# Altium project DataLoggingThermometer.PrjPcb
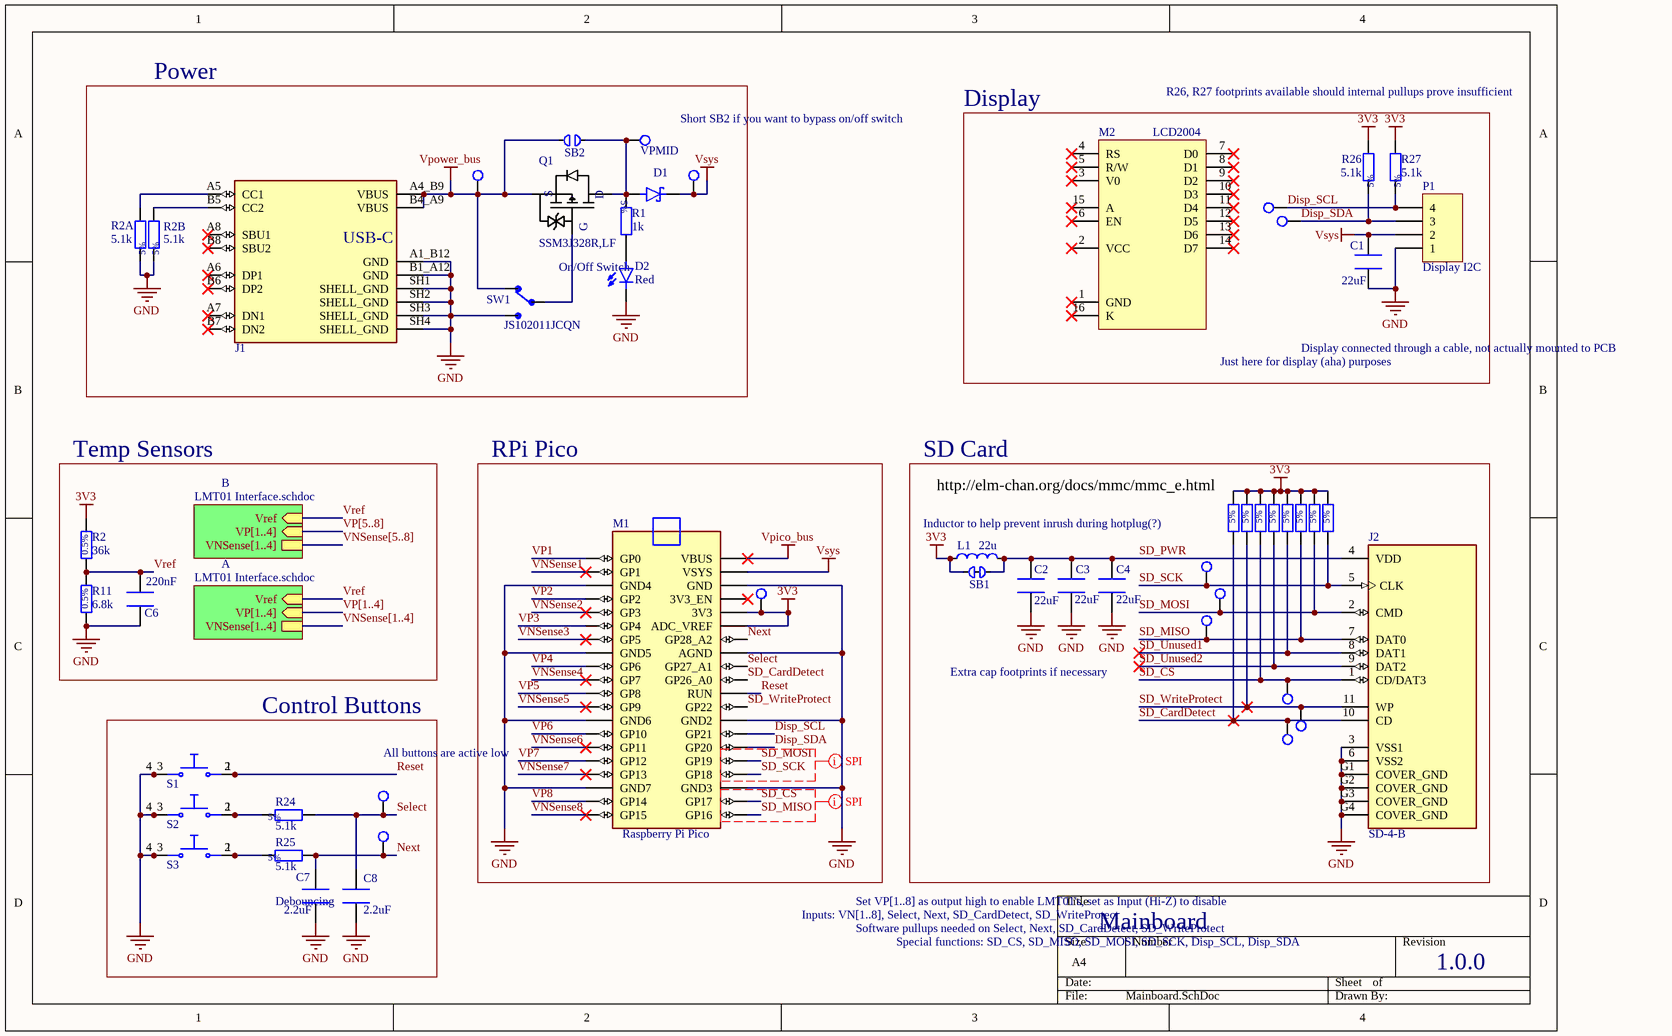
[diagram p0: Mainboard.SchDoc]
version: 1.0.0
2 sheets, 113 parts. Net scope: hierarchical (ports join the sheet entries above them; power ports are global).
Board file: Mainboard.PcbDoc
Sheets:
  Mainboard.SchDoc
    B = LMT01 Interface.schdoc
    A = LMT01 Interface.schdoc

## Sheet Mainboard.SchDoc
size A4

### Parts
3V3  Test Pad  [Test Pad]  (value not drawn)  (no BOM)
C1  22uF  [CAPACITOR_0805_2012M-70N]
C2  22uF  [CAPACITOR_0805_2012M-70N]
C3  22uF  [CAPACITOR_0805_2012M-70N]
C4  22uF  [CAPACITOR_0805_2012M-70N]
C6  220nF  [CAPACITOR_0805_2012M-70N]
C7  2.2uF  [CAPACITOR_0805_2012M-70N]
C8  2.2uF  [CAPACITOR_0805_2012M-70N]
CS  Test Pad  [Test Pad]  (value not drawn)  (no BOM)
D1  SS0520_R1_00001  [SOD123-1.35mm-N]  (value not drawn)
D2  Colour: Red  [LED_0603_1608M_0.80mm]  (hidden comment: LTST-C190 Series)
J1  USB4105-GF-A  [GCT_USB4105-GF-A]  (value not drawn)
J2  SD-4-B  [CUI_SD-4-B]
L1  22u  [CAPACITOR_1210_3225M_270N]
M1  RASPBERRY_PI_PICO  [RASPBERRY_PI_PICO_SOCKETED]  (value not drawn)
M2  LCD2004  [LCD2004]
MISO  Test Pad  [Test Pad]  (value not drawn)  (no BOM)
MOSI  Test Pad  [Test Pad]  (value not drawn)  (no BOM)
NXT  Test Pad  [Test Pad]  (value not drawn)  (no BOM)
P1  Display I2C  [HDR1X4H]  (no BOM)
Q1  SSM3J328R,LF  [SOT23F-3-0.8mm]
R1  1k  [Resistor_0805_2012M-50N]
R2  36k  [Resistor_0805_2012M-50N]
R2A  5.1k  [Resistor_0805_2012M-50N]
R2B  5.1k  [Resistor_0805_2012M-50N]
R3  47k  [Resistor_0805_2012M-50N]  (value not drawn)
R4  47k  [Resistor_0805_2012M-50N]  (value not drawn)
R5  47k  [Resistor_0805_2012M-50N]  (value not drawn)
R6  47k  [Resistor_0805_2012M-50N]  (value not drawn)
R7  47k  [Resistor_0805_2012M-50N]  (value not drawn)
R8  47k  [Resistor_0805_2012M-50N]  (value not drawn)
R9  47k  [Resistor_0805_2012M-50N]  (value not drawn)
R10  47k  [Resistor_0805_2012M-50N]  (value not drawn)
R11  6.8k  [Resistor_0805_2012M-50N]
R24  5.1k  [Resistor_0805_2012M-50N]
R25  5.1k  [Resistor_0805_2012M-50N]
R26  5.1k  [Resistor_0805_2012M-50N]
R27  5.1k  [Resistor_0805_2012M-50N]
S1  PTS645SL43SMTR92LFS  [SW_PTS645SL43SMTR92LFS]  (value not drawn)
S2  PTS645SL43SMTR92LFS  [SW_PTS645SL43SMTR92LFS]  (value not drawn)
S3  PTS645SL43SMTR92LFS  [SW_PTS645SL43SMTR92LFS]  (value not drawn)
SB1  Solder Jumper Normally Closed 0201  [Solder Bridge Closed 0201]  (value not drawn)  (net tie, no BOM)
SB2  Solder Jumper Normally Open 0201  [Solder Bridge Open 0201]  (value not drawn)  (no BOM)
SCK  Test Pad  [Test Pad]  (value not drawn)  (no BOM)
SCL  Test Pad  [Test Pad]  (value not drawn)  (no BOM)
SD_CD  Test Pad  [Test Pad]  (value not drawn)  (no BOM)
SD_WP  Test Pad  [Test Pad]  (value not drawn)  (no BOM)
SDA  Test Pad  [Test Pad]  (value not drawn)  (no BOM)
SEL  Test Pad  [Test Pad]  (value not drawn)  (no BOM)
SW1  JS102011JCQN  [SW_JS102011JCQN]
VPBUS  Test Pad  [Test Pad]  (value not drawn)  (no BOM)
VPMID  Test Pad  [Test Pad]  (value not drawn)  (no BOM)
VSYS  Test Pad  [Test Pad]  (value not drawn)  (no BOM)

### Blocks framed on the sheet
Power: D1 D2 J1 Q1 R1 R2A R2B SB2 SW1 VPBUS VPMID VSYS
Display: C1 M2 P1 R26 R27 SCL SDA
Temp Sensors: C6 R2 R11
RPi Pico: 3V3 M1
SD Card: C2-C4 CS J2 L1 MISO MOSI R3-R10 SB1 SCK SD_CD SD_WP
Control Buttons: C7 C8 NXT R24 R25 S1-S3 SEL

### Sub-sheets
A = LMT01 Interface.schdoc: VP[1..4] (in), VNSense[1..4], Vref (in)
B = LMT01 Interface.schdoc: VP[1..4] (in), VNSense[1..4], Vref (in)

### Nets
3V3: 3V3.1 L1.1 M1.3V3 M1.ADC_VREF R2.2 R3.2 R4.2 R5.2 R6.2 R7.2 R8.2 R9.2 R10.2 R26.2 R27.2 SB1.1
GND: C1.1 C2.1 C3.1 C4.1 C6.1 C7.1 C8.1 D2.C J1.A1_B12(GND) J1.B1_A12(GND) J1.SH1(SHELL_GND) J1.SH2(SHELL_GND) J1.SH3(SHELL_GND) J1.SH4(SHELL_GND) J2.3(VSS1) J2.6(VSS2) J2.G1(COVER_GND) J2.G2(COVER_GND) J2.G3(COVER_GND) J2.G4(COVER_GND) M1.AGND M1.GND M1.GND2 M1.GND3 M1.GND4 M1.GND5 M1.GND6 M1.GND7 P1.1 R2A.1 R2B.1 R11.1 S1.3 S1.4 S2.3 S2.4 S3.3 S3.4 SW1.3
Vpico_bus: M1.VBUS
Vpower_bus: J1.A4_B9(VBUS) J1.B4_A9(VBUS) Q1.2(S) SB2.2 SW1.1 VPBUS.1
Vsys: C1.2 D1.C M1.VSYS P1.2 VSYS.1
Disp_SCL: M1.GP21 P1.4 R27.1 SCL.1
Disp_SDA: M1.GP20 P1.3 R26.1 SDA.1
Next: C7.2 M1.GP28_A2 NXT.1 R25.2
Reset: M1.RUN S1.1 S1.2(,_2)
SD_CardDetect: J2.10(CD) M1.GP26_A0 R3.1 SD_CD.1
SD_CS: CS.1 J2.1(CD/DAT3) M1.GP17 R5.1
SD_MISO: J2.7(DAT0) M1.GP16 MISO.1 R8.1
SD_MOSI: J2.2(CMD) M1.GP19 MOSI.1 R9.1
SD_PWR: C2.2 C3.2 C4.2 J2.4(VDD) L1.2 SB1.2
SD_SCK: J2.5(CLK) M1.GP18 R10.1 SCK.1
SD_Unused1: J2.8(DAT1) R7.1
SD_Unused2: J2.9(DAT2) R6.1
SD_WriteProtect: J2.11(WP) M1.GP22 R4.1 SD_WP.1
Select: C8.2 M1.GP27_A1 R24.2 SEL.1
VNSense1: M1.GP1
VNSense2: M1.GP3
VNSense3: M1.GP5
VNSense4: M1.GP7
VNSense5: M1.GP9  [project net VNSense1]
VNSense6: M1.GP11  [project net VNSense2]
VNSense7: M1.GP13  [project net VNSense3]
VNSense8: M1.GP15  [project net VNSense4]
VP1: M1.GP0
VP2: M1.GP2
VP3: M1.GP4
VP4: M1.GP6
VP5: M1.GP8  [project net VP1]
VP6: M1.GP10  [project net VP2]
VP7: M1.GP12  [project net VP3]
VP8: M1.GP14  [project net VP4]
Vref: C6.2 R2.1 R11.2 ; sheet B/Vref, sheet A/Vref
NetD1_A: D1.A Q1.3(D) R1.1 SB2.1 VPMID.1
NetD2_A: D2.A R1.2
NetJ1_A5: J1.A5(CC1) R2A.2
NetJ1_B5: J1.B5(CC2) R2B.2
NetQ1_1: Q1.1(G) SW1.2
NetR24_1: R24.1 S2.1 S2.2(,_2)
NetR25_1: R25.1 S3.1 S3.2(,_2)

Not connected (* = marked no-connect by the designer): J1 A6(DP1)* A7(DN1)* A8(SBU1)* B6(DP2)* B7(DN2)* B8(SBU2)*; M1 3V3_EN*; M2 1(GND)* 2(VCC)* 3(V0)* 4(RS)* 5(R/W)* 6(EN)* 7(D0)* 8(D1)* 9(D2)* 10(D3)* 11(D4)* 12(D5)* 13(D6)* 14(D7)* 15(A)* 16(K)*

### Buses and harness runs
bus VNSense[1..4] = sheet A/VNSense[1..4]
bus VNSense[5..8] = sheet B/VNSense[1..4]
bus VP[1..4] = sheet A/VP[1..4]
bus VP[5..8] = sheet B/VP[1..4]

### Layout directives
net class SPI: SD_CS, SD_MISO, SD_MOSI, SD_SCK

### Notes on the sheet
- R26, R27 footprints available should internal pullups prove insufficient
- Short SB2 if you want to bypass on/off switch
- (near J1) USB-C
- (near SW1) On/Off Switch
- (near M2) Just here for display (aha) purposes
- (near M2) Display connected through a cable, not actually mounted to PCB
- (near R3) http://elm-chan.org/docs/mmc/mmc_e.html
- (near R3) Inductor to help prevent inrush during hotplug(?)
- Extra cap footprints if necessary
- (near S1) All buttons are active low
- Debouncing
- Inputs: VN[1..8], Select, Next, SD_CardDetect, SD_WriteProtect
- (near C8) Set VP[1..8] as output high to enable LMT01's, set as Input (Hi-Z) to disable
- Software pullups needed on Select, Next, SD_CardDetect, SD_WriteProtect
- Special functions: SD_CS, SD_MISO, SD_MOSI, SD_SCK, Disp_SCL, Disp_SDA
- Mainboard
- (in symbol RASPBERRY_PI_PICO) Raspberry Pi Pico

### Library data of the parts
C1 = C0805C226M9PACTU: Passive - Capacitor, X5R, 22uF Max, 6.3V, 0805 (2012 Metric), ±20%, -55°C ~ 85°C. 8.8uF @ 5V; APSS Standard Part: APSS Standard; Capacitance at Rated Voltage: 30%; Tolerance: ±20%; Temperature Coefficient: X5R; Rated Voltage: 6.3V; Temp Range: -55°C ~ 85°C; Package: 0805; Supplier 1: Digikey; Supplier 1 Part No.: 399-C0805C226M9PAC7800CT-ND; MF Part No.: C0805C226M9PACTU; Value: 22uF
C2-C4 = GRM21BR61C226ME44L: Passive - Capacitor, X5R, 22uF Max, 16V, 0805 (2012 Metric), ±20%, -55°C ~ 85°C. 9.4uF @ 5V, 3.2uF @ 15V, 1.9uF @ 25V; APSS Standard Part: APSS Standard; Capacitance at Rated Voltage: 10%; Tolerance: ±20%; Temperature Coefficient: X5R; Rated Voltage: 16V; Temp Range: -55°C ~ 85°C; Package: 0805; Supplier 1: Digikey; Supplier 1 Part No.: 490-10747-1-ND; MF Part No.: GRM21BR61C226ME44L; Value: 22uF
C6 = C0805C224K1RAC7800: Passive - Capacitor, X7R, 220nF Max, 100V, 0805 (2012 Metric), ±10%, -55°C ~ 85°C. 200nF @ 10V, 110nF @ 50V, 55nF @ 100V; APSS Standard Part: APSS Standard; Capacitance at Rated Voltage: 25%; Tolerance: ±10%; Temperature Coefficient: X7R; Rated Voltage: 100V; Temp Range: -55°C ~ 85°C; Package: 0805; Supplier 1: Digikey; Supplier 1 Part No.: 399-C0805C224K1RAC7800CT-ND; MF Part No.: C0805C224K1RAC7800; Value: 220nF
C7 C8 = C0805C225K8PACTU: Passive - Capacitor, X5R, 2.2uF Max, 10V, 0805 (2012 Metric), ±10%, -55°C ~ 85°C. 2uF @ 5V, 1.1uF @ 10V; APSS Standard Part: APSS Standard; Capacitance at Rated Voltage: 50%; Tolerance: ±10%; Temperature Coefficient: X5R; Rated Voltage: 10V; Temp Range: -55°C ~ 85°C; Package: 0805; Supplier 1: Digikey; Supplier 1 Part No.: 399-C0805C225K8PAC7800-ND; MF Part No.: C0805C225K8PACTU; Value: 2.2uF
D1 = SS0520_R1_00001: Diode - Low Forward Voltage, Schottky, 385 mV @ 500 mA, 75 µA Reverse @ 10 V, SOD-123; APSS Standard Part: APSS Standard; Temp Range: -55°C ~ 125°C; Rated Voltage: 20V Reverse; MF Part No.: SS0520_R1_00001; Package: SOD-123; Supplier 1: Digikey; Supplier 1 Part No.: 3757-SS0520_R1_00001CT-ND
D2 = LTST-C190 Series: Diode - LED, 0603; APSS Standard Part: APSS Standard; MF Part No.: LTST-C190KAKT; Temp Range: -30°C ~ 85°C; Rated Voltage: 5V Reverse; Package: 0603; Supplier 1: Digikey; Supplier 1 Part No.: 160-1433-1-ND
J1 = USB4105-GF-A: Header - USB-C 2.0 Receptacle Connector 24 (16+8 Dummy) Position Surface Mount, Right Angle; Through Hole; APSS Standard Part: APSS Standard; Rated Voltage: 48VDC; Temp Range: -40°C ~ 85°C; MF Part No.: USB4105-GF-A; Supplier 1: Digikey; Supplier 1 Part No.: 2073-USB4105-GF-ACT-ND
J2 = SD-4-B: SD Card Connector, 11 Positions, Connector, Push In, Pull Out, Surface Mount, 2.8 mm Height Above Board, Gold Flash; Value: *; MF Part No.: SD-4-B; Supplier 1: Digikey; Supplier 1 Part No.: 2223-Sd-4-BCT-ND
L1 = Generic Inductor: Passive - Inductor, Generic; MF Part No.: LSQPA322525T220MR; Tolerance: ±20%; Temp Range: -40°C ~ 125°C; Rated Current: 780 mA; DC Resistance: 351m; Saturation Current: 620mA; Self-Resonant Frequency: 17MHz; Type: Wirewound; Supplier 1: Digikey; Supplier 1 Part No.: 587-LSQPA322525T220MRCT-ND; Package: 1210; Value: 22u
M1 = RASPBERRY_PI_PICO: Raspberry Pi Board, Arm Cortex-M0+; Core Architecture:Arm; Core Sub-Architecture:Cortex-M0+; Kit Contents:Raspberry Pi Pico Board; No. Of Bits:32Bit; Silicon Core Number:Rp2040; Silicon Manufacturer:Raspberry Pi |Raspberry-Pi RASPBERRY PI PICO; MF Part No.: SC0917; Value: *; Supplier 1: Digikey; Supplier 1 Part No.: 2648-SC0917-ND
M2 = LCD2004: MF Part No.: CN0296D; Supplier 1: Digikey; Supplier 1 Part No.: 4411-CN0296D-ND
P1 = Header 4H: Header, 4-Pin, Right Angle
Q1 = SSM3J328R,LF: Transistor - MOSFET, P-Channel SSM3J328R,LF; APSS Standard Part: APSS Standard; Temp Range: 0°C ~ 150°C (TJ); Rated Voltage: 20 Vds; Power: 1W; MF Part No.: SSM3J328R,LF; Package: SOT23-3; Supplier 1: Digikey; Supplier 1 Part No.: SSM3J328RLFCT-ND
R1 = RMCF0805JT Series: Passive - Resistor Series, 0805, 5%, 100m - 22M, E24, 0.063W, 1/16W, ±200ppm/°C, -55°C ~ 155°C, 0805 (2012 Metric); APSS Standard Part: APSS Standard; MF Part No.: RMCF0805JT1K00; Power: 1/8W; Value Range: 100m ~ 22M; Rated Voltage: 150V; Tolerance: 5%; E Series: E24; Temp Range: -55°C ~ 155°C; Supplier 1: Digikey; Supplier 1 Part No.: RMCF0805JT1K00CT-ND; Package: 0805; Temperature Coefficient: ±200ppm/°C; Value: 1k
R2 = RG2012P-xxx-D-T5 Series: Passive - Resistor Series, 0805, 0.5%, 10 - 1M, E24, 0.063W, 1/8W, ±25ppm/°C, -55°C ~ 155°C, 0805 (2012 Metric); APSS Standard Part: APSS Standard; MF Part No.: RG2012P-363-D-T5; Value Range: 10 ~ 1M; Rated Voltage: 150V; Tolerance: 0.5%; Power: 1/8W; E Series: E24; Temp Range: -55°C ~ 155°C; Supplier 1: Digikey; Supplier 1 Part No.: RG2012P-363-D-T5-ND; Package: 0805; Temperature Coefficient: ±25ppm/°C; Value: 36k
R2A R2B R24-R27 = RMCF0805JT Series: Passive - Resistor Series, 0805, 5%, 100m - 22M, E24, 0.063W, 1/16W, ±200ppm/°C, -55°C ~ 155°C, 0805 (2012 Metric); MF Part No.: RMCF0805JT5K10; APSS Standard Part: APSS Standard; Power: 1/8W; Value Range: 100m ~ 22M; Rated Voltage: 150V; Tolerance: 5%; E Series: E24; Temp Range: -55°C ~ 155°C; Supplier 1: Digikey; Supplier 1 Part No.: RMCF0805JT5K10CT-ND; Package: 0805; Temperature Coefficient: ±200ppm/°C; Value: 5.1k
R3-R10 = RMCF0805JT Series: Passive - Resistor Series, 0805, 5%, 100m - 22M, E24, 0.063W, 1/16W, ±200ppm/°C, -55°C ~ 155°C, 0805 (2012 Metric); APSS Standard Part: APSS Standard; MF Part No.: RMCF0805JT47K0; Power: 1/8W; Value Range: 100m ~ 22M; Rated Voltage: 150V; Tolerance: 5%; E Series: E24; Temp Range: -55°C ~ 155°C; Supplier 1: Digikey; Supplier 1 Part No.: RMCF0805JT47K0CT-ND; Package: 0805; Temperature Coefficient: ±200ppm/°C; Value: 47k
R11 = RG2012P-xxx-D-T5 Series: Passive - Resistor Series, 0805, 0.5%, 10 - 1M, E24, 0.063W, 1/8W, ±25ppm/°C, -55°C ~ 155°C, 0805 (2012 Metric); APSS Standard Part: APSS Standard; MF Part No.: RG2012P-682-D-T5; Value Range: 10 ~ 1M; Rated Voltage: 150V; Tolerance: 0.5%; Power: 1/8W; E Series: E24; Temp Range: -55°C ~ 155°C; Supplier 1: Digikey; Supplier 1 Part No.: RG2012P-682-D-T5-ND; Package: 0805; Temperature Coefficient: ±25ppm/°C; Value: 6.8k
S1-S3 = PTS645SL43SMTR92LFS: Switch - SPST, Momentary, Normally Open, 50mA @ 12VDC; APSS Standard Part: APSS Standard; Rated Voltage: 250V AC; Temp Range: -40°C ~ 85°C; MF Part No.: SW_PTS645SL43SMTR92LFS; Mounting Type: Surface Mount; Supplier 1: Digikey; Supplier 1 Part No.: CKN10880CT-ND
SW1 = JS102011JCQN: Switch Slide Spdt 300ma 6v; MF Part No.: JS102011JCQN; Rated Voltage: 6V; Supplier 1: Digikey; Supplier 1 Part No.: CKN10721CT-ND
SB1 = Solder Jumper Normally Closed 0201: DEBUG: DEBUG
SB2 = Solder Jumper Normally Open 0201: DEBUG: DEBUG

## Sheet LMT01 Interface.schdoc
size A4
Used 2 times, as channels B, A. Parts and nets are listed once, with the designators drawn on the sheet.
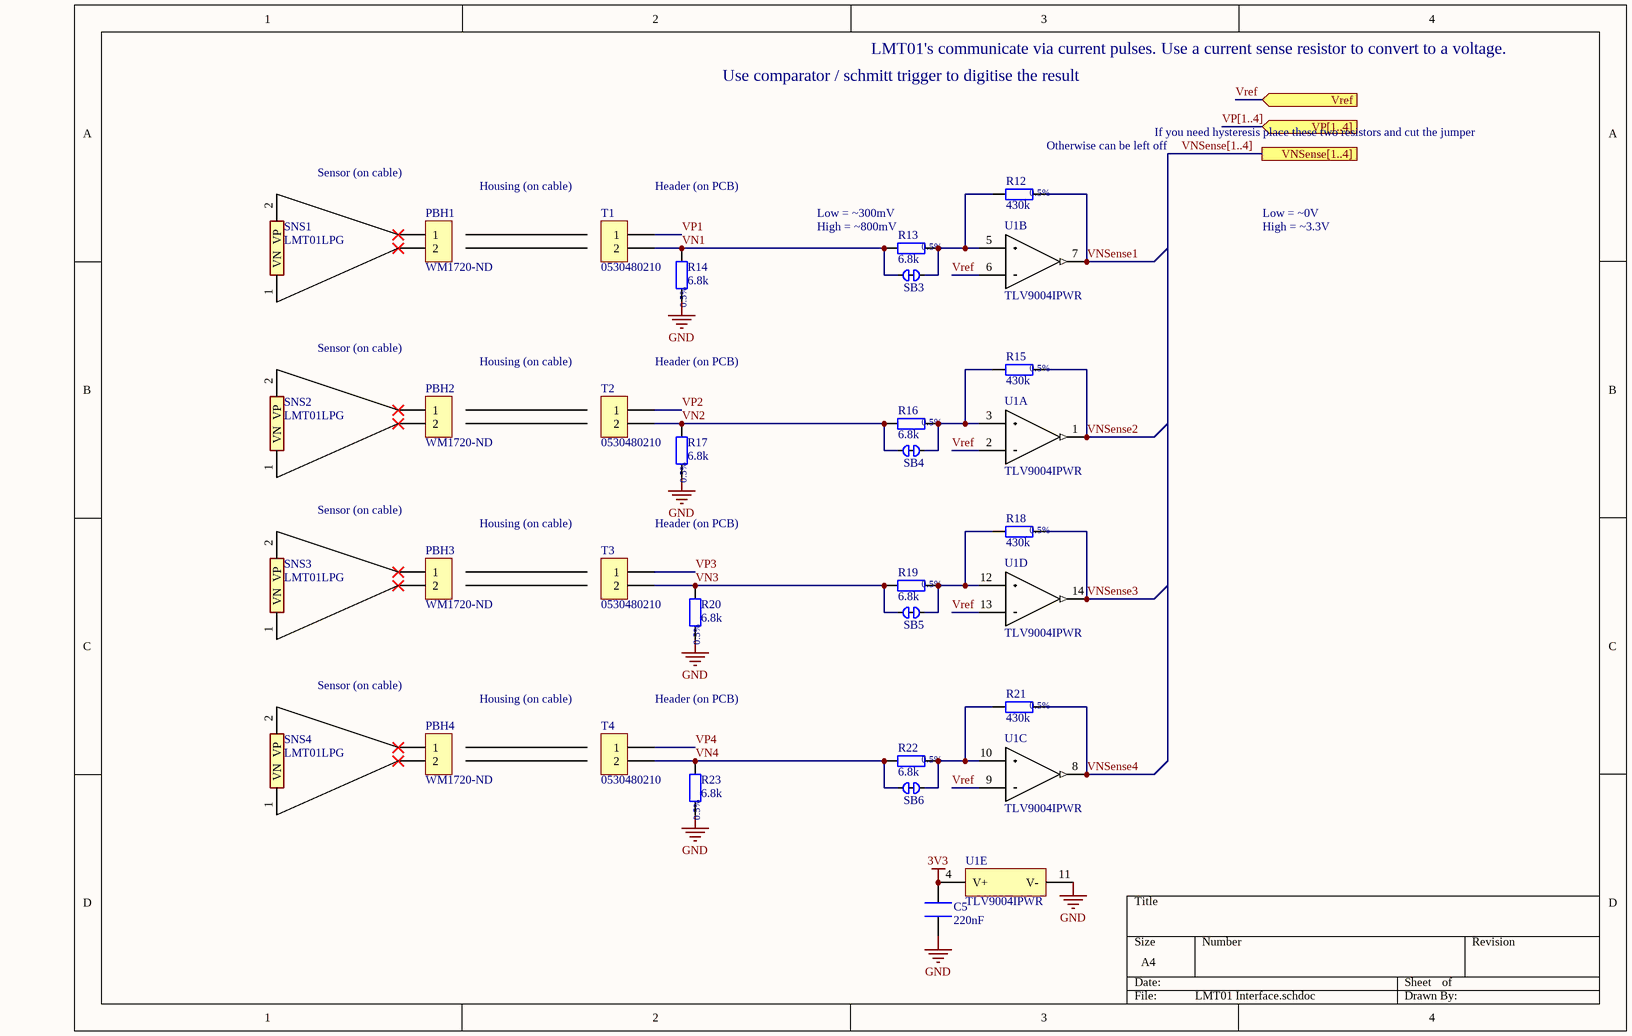
[diagram p1: LMT01 Interface.schdoc]

### Parts
C5  220nF  [CAPACITOR_0805_2012M-70N]
PBH1  MF Part No.: WM1720-ND  (hidden comment: 0530480210)  (mechanical)
PBH2  MF Part No.: WM1720-ND  (hidden comment: 0530480210)  (mechanical)
PBH3  MF Part No.: WM1720-ND  (hidden comment: 0530480210)  (mechanical)
PBH4  MF Part No.: WM1720-ND  (hidden comment: 0530480210)  (mechanical)
R12  430k  [Resistor_0805_2012M-50N]
R13  6.8k  [Resistor_0805_2012M-50N]
R14  6.8k  [Resistor_0805_2012M-50N]
R15  430k  [Resistor_0805_2012M-50N]
R16  6.8k  [Resistor_0805_2012M-50N]
R17  6.8k  [Resistor_0805_2012M-50N]
R18  430k  [Resistor_0805_2012M-50N]
R19  6.8k  [Resistor_0805_2012M-50N]
R20  6.8k  [Resistor_0805_2012M-50N]
R21  430k  [Resistor_0805_2012M-50N]
R22  6.8k  [Resistor_0805_2012M-50N]
R23  6.8k  [Resistor_0805_2012M-50N]
SB3  Solder Jumper Normally Closed 0201  [Solder Bridge Closed 0201]  (value not drawn)  (net tie, no BOM)
SB4  Solder Jumper Normally Closed 0201  [Solder Bridge Closed 0201]  (value not drawn)  (net tie, no BOM)
SB5  Solder Jumper Normally Closed 0201  [Solder Bridge Closed 0201]  (value not drawn)  (net tie, no BOM)
SB6  Solder Jumper Normally Closed 0201  [Solder Bridge Closed 0201]  (value not drawn)  (net tie, no BOM)
SNS1  LMT01LPG  [LPG0002A]  (mechanical)
SNS2  LMT01LPG  [LPG0002A]  (mechanical)
SNS3  LMT01LPG  [LPG0002A]  (mechanical)
SNS4  LMT01LPG  [LPG0002A]  (mechanical)
T1  0530480210  [MOLEX_0530480210]
T2  0530480210  [MOLEX_0530480210]
T3  0530480210  [MOLEX_0530480210]
T4  0530480210  [MOLEX_0530480210]
U1  TLV9004IPWR  [TSSOP65P640X120-14N]  (parts A,B,C,D,E of 5)

### Ports
VNSense[1..4], VP[1..4] (in), Vref (in)

### Nets
3V3: C5.2 U1.4(V+)
GND: C5.1 R14.1 R17.1 R20.1 R23.1 U1.11(V-)
VN1: R13.2 R14.2 SB3.2 T1.2
VN2: R16.2 R17.2 SB4.2 T2.2
VN3: R19.2 R20.2 SB5.2 T3.2
VN4: R22.2 R23.2 SB6.2 T4.2
VNSense1: R12.1 U1.7(OUT2)
VNSense2: R15.1 U1.1(OUT1)
VNSense3: R18.1 U1.14(OUT4)
VNSense4: R21.1 U1.8(OUT3)
VP1: T1.1
VP2: T2.1
VP3: T3.1
VP4: T4.1
Vref: U1.2(IN1-) U1.6(IN2-) U1.9(IN3-) U1.13(IN4-) ; port Vref
NetR12_2: R12.2 R13.1 SB3.1 U1.5(IN2+)
NetR15_2: R15.2 R16.1 SB4.1 U1.3(IN1+)
NetR18_2: R18.2 R19.1 SB5.1 U1.12(IN4+)
NetR21_2: R21.2 R22.1 SB6.1 U1.10(IN3+)

Not connected (* = marked no-connect by the designer): PBH1 1* 2*; PBH2 1* 2*; PBH3 1* 2*; PBH4 1* 2*; SNS1 1(VN) 2(VP); SNS2 1(VN) 2(VP); SNS3 1(VN) 2(VP); SNS4 1(VN) 2(VP)

### Channels
B: designators C5=C5B PBH1=PBH1B PBH2=PBH2B PBH3=PBH3B PBH4=PBH4B R12=R12B R13=R13B R14=R14B R15=R15B R16=R16B R17=R17B R18=R18B R19=R19B R20=R20B R21=R21B R22=R22B R23=R23B SB3=SB3B SB4=SB4B SB5=SB5B SB6=SB6B SNS1=SNS1B SNS2=SNS2B SNS3=SNS3B SNS4=SNS4B T1=T1 T2=T2B T3=T3B T4=T4B U1=U1B; ports Vref=Vref
A: designators end in A; ports Vref=Vref

### Buses and harness runs
bus VNSense[1..4] = port VNSense[1..4]
bus VP[1..4] = port VP[1..4]

### Notes on the sheet
- Use comparator / schmitt trigger to digitise the result
- LMT01's communicate via current pulses. Use a current sense resistor to convert to a voltage.
- (near SNS1) Sensor (on cable)
- (near R12) Otherwise can be left off
- If you need hysteresis place these two resistors and cut the jumper
- (near PBH1) Housing (on cable)
- (near T1) Header (on PCB)
- Low = ~300mV
- High = ~800mV
- Low = ~0V
- High = ~3.3V
- (near SNS2) Sensor (on cable)
- (near PBH2) Housing (on cable)
- (near T2) Header (on PCB)
- Sensor (on cable)
- (near PBH3) Housing (on cable)
- Header (on PCB)
- (near SNS4) Sensor (on cable)
- (near PBH4) Housing (on cable)
- (near T4) Header (on PCB)

### Library data of the parts
C5 = C0805C224K1RAC7800: as C6 on sheet Mainboard; Tolerance: ±10%; Temperature Coefficient: X7R; Rated Voltage: 100V; Temp Range: -55°C ~ 85°C; Package: 0805; Supplier 1: Digikey; Supplier 1 Part No.: 399-C0805C224K1RAC7800CT-ND; MF Part No.: C0805C224K1RAC7800; Value: 220nF
PBH1-PBH4 = 0530480210: Housing - Picoblade 02-pin, TH, RA; APSS Standard Part: APSS Standard; Pitch: 1.25mm; Pins: 2; Supplier 1: Digikey; Supplier 1 Part No.: 0510210200
R12 R15 R18 R21 = RG2012P-xxx-D-T5 Series: Passive - Resistor Series, 0805, 0.5%, 10 - 1M, E24, 0.063W, 1/8W, ±25ppm/°C, -55°C ~ 155°C, 0805 (2012 Metric); APSS Standard Part: APSS Standard; MF Part No.: RG2012P-434-D-T5; Value Range: 10 ~ 1M; Rated Voltage: 150V; Tolerance: 0.5%; Power: 1/8W; E Series: E24; Temp Range: -55°C ~ 155°C; Supplier 1: Digikey; Supplier 1 Part No.: RG2012P-434-D-T5-ND; Package: 0805; Temperature Coefficient: ±25ppm/°C; Value: 430k
R13 R14 R16 R17 R19 R20 R22 R23 = RG2012P-xxx-D-T5 Series: as R11 on sheet Mainboard; Tolerance: 0.5%; Power: 1/8W; E Series: E24; Temp Range: -55°C ~ 155°C; Supplier 1: Digikey; Supplier 1 Part No.: RG2012P-682-D-T5-ND; Package: 0805; Temperature Coefficient: ±25ppm/°C; Value: 6.8k
SNS1-SNS4 = LMT01LPG: 0.5Â°C Accurate 2-pin Temperature Sensor with a Pulse Train Interface; Rated Voltage: 2V ~ 5.5V; MF Part No.: LMT01LPG; Package: TO-92-2; Supplier 1: Digikey; Supplier 1 Part No.: 296-42299-ND
T1-T4 = 0530480210: Header - Picoblade 02-pin, TH, RA; APSS Standard Part: APSS Standard; Pitch: 1.25mm; Mounting Type: Through-hole; Orientation: Right Angle; Pins: 2; Supplier 1: Digikey; Supplier 1 Part No.: 530480210; MF Part No.: 0530480210
U1 = TLV9004IPWR: IC - Opamp, Low Power, 4-Channel, 1MHz GBWP, RRIO, 1.8V to 5.5V, -40 to 125, 14-TSSOP; APSS Standard Part: APSS Standard; Temp Range: -40°C ~ 125°C; MF Part No.: TLV9004IPWR; Package: TSSOP-14; Supplier 1: Digikey; Supplier 1 Part No.: 296-51827-1-ND; Rated Voltage: 5.5V
SB3-SB6 = Solder Jumper Normally Closed 0201: DEBUG: DEBUG

## Nets that join several sheets
3V3: Mainboard (16 pins), B (C5B.2 U1B.4), A (C5A.2 U1A.4)
GND: Mainboard (39 pins), B (6 pins), A (6 pins)
VNSense1: Mainboard (M1.GP1), A (R12A.1 U1A.7)
VNSense1: Mainboard (M1.GP9), B (R12B.1 U1B.7)
VNSense2: Mainboard (M1.GP3), A (R15A.1 U1A.1)
VNSense2: Mainboard (M1.GP11), B (R15B.1 U1B.1)
VNSense3: Mainboard (M1.GP5), A (R18A.1 U1A.14)
VNSense3: Mainboard (M1.GP13), B (R18B.1 U1B.14)
VNSense4: Mainboard (M1.GP7), A (R21A.1 U1A.8)
VNSense4: Mainboard (M1.GP15), B (R21B.1 U1B.8)
VP1: Mainboard (M1.GP0), A (T1A.1)
VP1: Mainboard (M1.GP8), B (T1.1)
VP2: Mainboard (M1.GP2), A (T2A.1)
VP2: Mainboard (M1.GP10), B (T2B.1)
VP3: Mainboard (M1.GP4), A (T3A.1)
VP3: Mainboard (M1.GP12), B (T3B.1)
VP4: Mainboard (M1.GP6), A (T4A.1)
VP4: Mainboard (M1.GP14), B (T4B.1)
Vref: Mainboard (C6.2 R2.1 R11.2), B (U1B.2 U1B.6 U1B.9 U1B.13), A (U1A.2 U1A.6 U1A.9 U1A.13)

## Assembly variants
Minimal: not fitted C2 C3 C5A C5B C7 C8 C? D2 L1 Q1 R1 R12A R12B R13A R13B R15A R15B R16A R16B R18A R18B R19A R19B R21A R21B R22A R22B SW1